# Altium schematic sheet Schematic_DEBUGGER.schdoc
size 194 x 190 mm
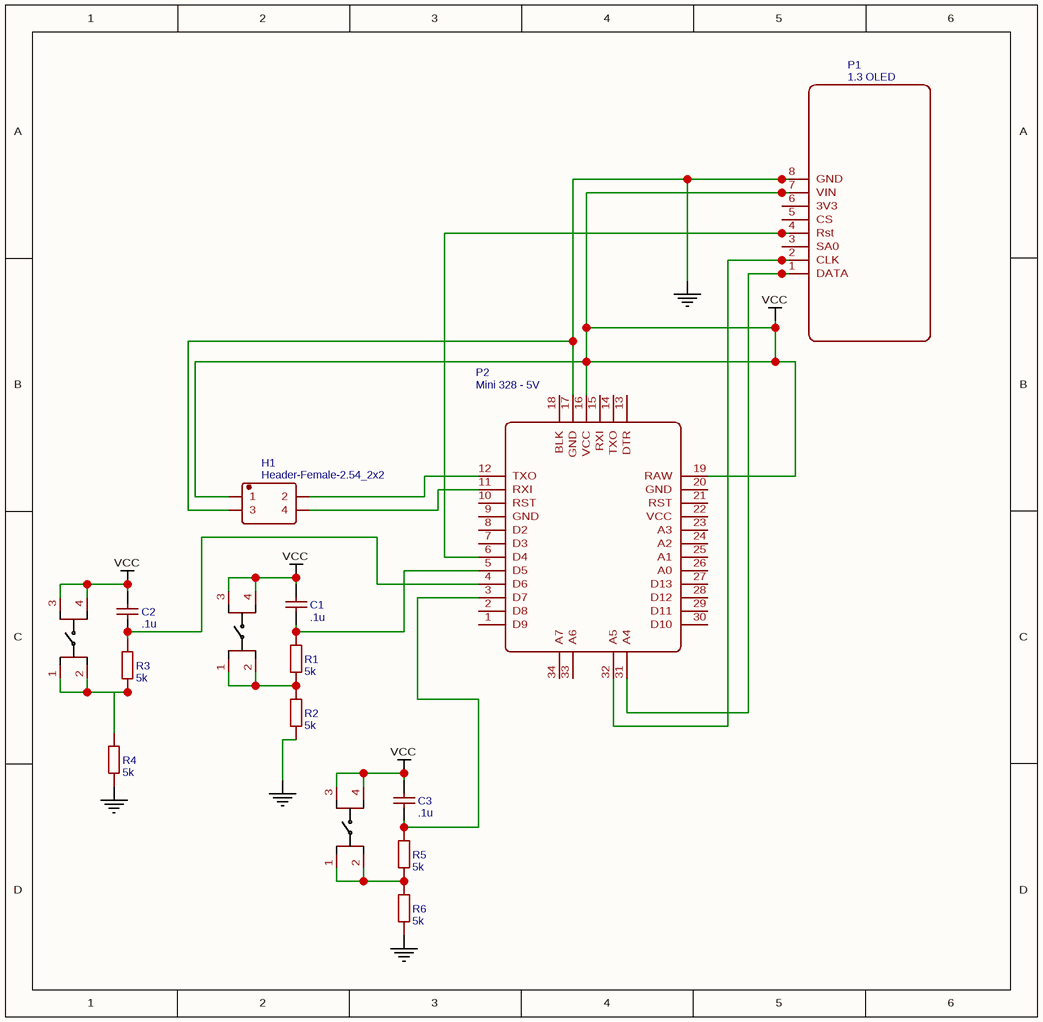
[diagram p0: Schematic_DEBUGGER.schdoc]

## Parts
B1  TS-1102-5016  [KEY-6.0*6.0-2]  (value not drawn)
B2  TS-1102-5016  [KEY-6.0*6.0-2]  (value not drawn)
B3  TS-1102-5016  [KEY-6.0*6.0-2]  (value not drawn)
C1  .1u  [RAD-0.2]
C2  .1u  [RAD-0.2]
C3  .1u  [RAD-0.2]
H1  Header-Female-2.54_2x2  [DIP-2X2.54MM-4P]
P1  1.3 OLED  [1.3 OLED]
P2  Mini 328 - 5V  [MINI 328 - 5V]
R1  5k  [AXIAL-0.3]
R2  5k  [AXIAL-0.3]
R3  5k  [AXIAL-0.3]
R4  5k  [AXIAL-0.3]
R5  5k  [AXIAL-0.3]
R6  5k  [AXIAL-0.3]

## Nets
GND: H1.3 P1.8(GND) P2.17(GND) R2.1 R4.1 R6.1
VCC: B1.3 B1.4 B2.3 B2.4 B3.3 B3.4 C1.2 C2.2 C3.2 H1.1 P1.7(VIN) P2.16(VCC) P2.19(RAW)
NetB1_1: B1.1 B1.2 R1.1 R2.2
NetB2_1: B2.1 B2.2 R3.1 R4.2
NetB3_1: B3.1 B3.2 R5.1 R6.2
NetC1_1: C1.1 P2.5(D5) R1.2
NetC2_1: C2.1 P2.4(D6) R3.2
NetC3_1: C3.1 P2.3(D7) R5.2
NetH1_2: H1.2 P2.12(TXO)
NetH1_4: H1.4 P2.11(RXI)
NetP1_1: P1.1(DATA) P2.31(A4)
NetP1_2: P1.2(CLK) P2.32(A5)
NetP1_4: P1.4(Rst) P2.6(D4)

Not connected (* = marked no-connect by the designer): P1 3(SA0) 5(CS) 6(3V3); P2 1(D9) 2(D8) 7(D3) 8(D2) 9(GND) 10(RST) 13(DTR) 14(TXO) 15(RXI) 18(BLK) 20(GND) 21(RST) 22(VCC) 23(A3) 24(A2) 25(A1) 26(A0) 27(D13) 28(D12) 29(D11) 30(D10) 33(A6) 34(A7)

## Library data of the parts
B1-B3 = TS-1102-5016: BOM_Manufacturer: SOFNG; Contributor: EasyEDA; BOM_Supplier Part: C111609; BOM_Supplier: LCSC; BOM_Manufacturer Part: TS-1102-5016; spicePre: K
C1-C3 = .1u: BOM_Manufacturer: ReliaPro; BOM_Manufacturer Part: Ceramic capacitors47PF 3KV; nameAlias: Value; Contributor: LCSC; BOM_Supplier: LCSC; BOM_Supplier Part: C19375; spicePre: C; spiceSymbolName: Ceramic capacitors47PF 3KV
H1 = Header-Female-2.54_2x2: BOM_Manufacturer: CONNFLY; BOM_Manufacturer Part: DS1023-2*2SF11; Contributor: LCSC; BOM_Supplier: LCSC; BOM_Supplier Part: C92273; spicePre: H
P1 = 1.3 OLED: sourceId: 1T5FDZYC8; timeStamp: 1460016638; BOM_Supplier Part: undefined; BOM_Supplier: AdaFruit; BOM_Manufacturer Part: ?; spicePre: P
P2 = Mini 328 - 5V: sourceId: 1T5FDZYC8; timeStamp: 1460356551; BOM_Manufacturer Part: ?; spicePre: P
R1-R6 = 5k: nameAlias: Value(Ω); BOM_Manufacturer Part: ?; spicePre: R; spiceSymbolName: Res_AXIAL-0.3(1/8W)_EU